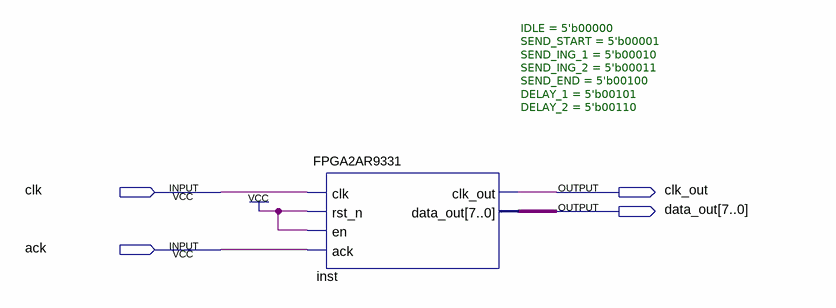
[diagram p0: schematic sheet]
// Quartus schematic main.bdf as structural Verilog: 1 symbols, 4 pins
module main (
  input  clk,
  input  ack,
  output clk_out,
  output [7:0] data_out
);

  FPGA2AR9331 #(.IDLE(5'b00000), .SEND_START(5'b00001), .SEND_ING_1(5'b00010), .SEND_ING_2(5'b00011), .SEND_END(5'b00100), .DELAY_1(5'b00101), .DELAY_2(5'b00110)) inst (
    .clk(clk), .rst_n(1'b1), .en(1'b1), .ack(ack), .clk_out(clk_out), .data_out(data_out));
endmodule
